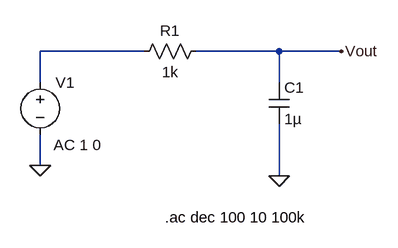
[diagram p0: schematic RC_low_pass.asc]
RC_low_pass.asc, the LTspice schematic file:
Version 4
SHEET 1 880 680
WIRE 304 224 144 224
WIRE 512 224 384 224
WIRE 608 224 512 224
WIRE 144 272 144 224
WIRE 512 272 512 224
WIRE 144 400 144 352
WIRE 512 416 512 336
FLAG 608 224 Vout
FLAG 512 416 0
FLAG 144 400 0
SYMBOL Voltage 144 256 R0
WINDOW 123 21 112 Left 2
SYMATTR InstName V1
SYMATTR Value ""
SYMATTR Value2 AC 1 0
SYMBOL res 400 208 R90
WINDOW 0 0 56 VBottom 2
WINDOW 3 32 56 VTop 2
SYMATTR InstName R1
SYMATTR Value 1k
SYMBOL Cap 496 272 R0
SYMATTR InstName C1
SYMATTR Value 1µ
TEXT 336 480 Left 2 !.ac dec 100 10 100k

The netlist it stands for:
* RC_low_pass.asc
V1 N001 0 AC 1 0
R1 Vout N001 1k
C1 Vout 0 1µ
.ac dec 100 10 100k
.backanno
.end